# EAGLE design RasPi-BplusHAT_CamSlot (EAGLE 7.2.0)
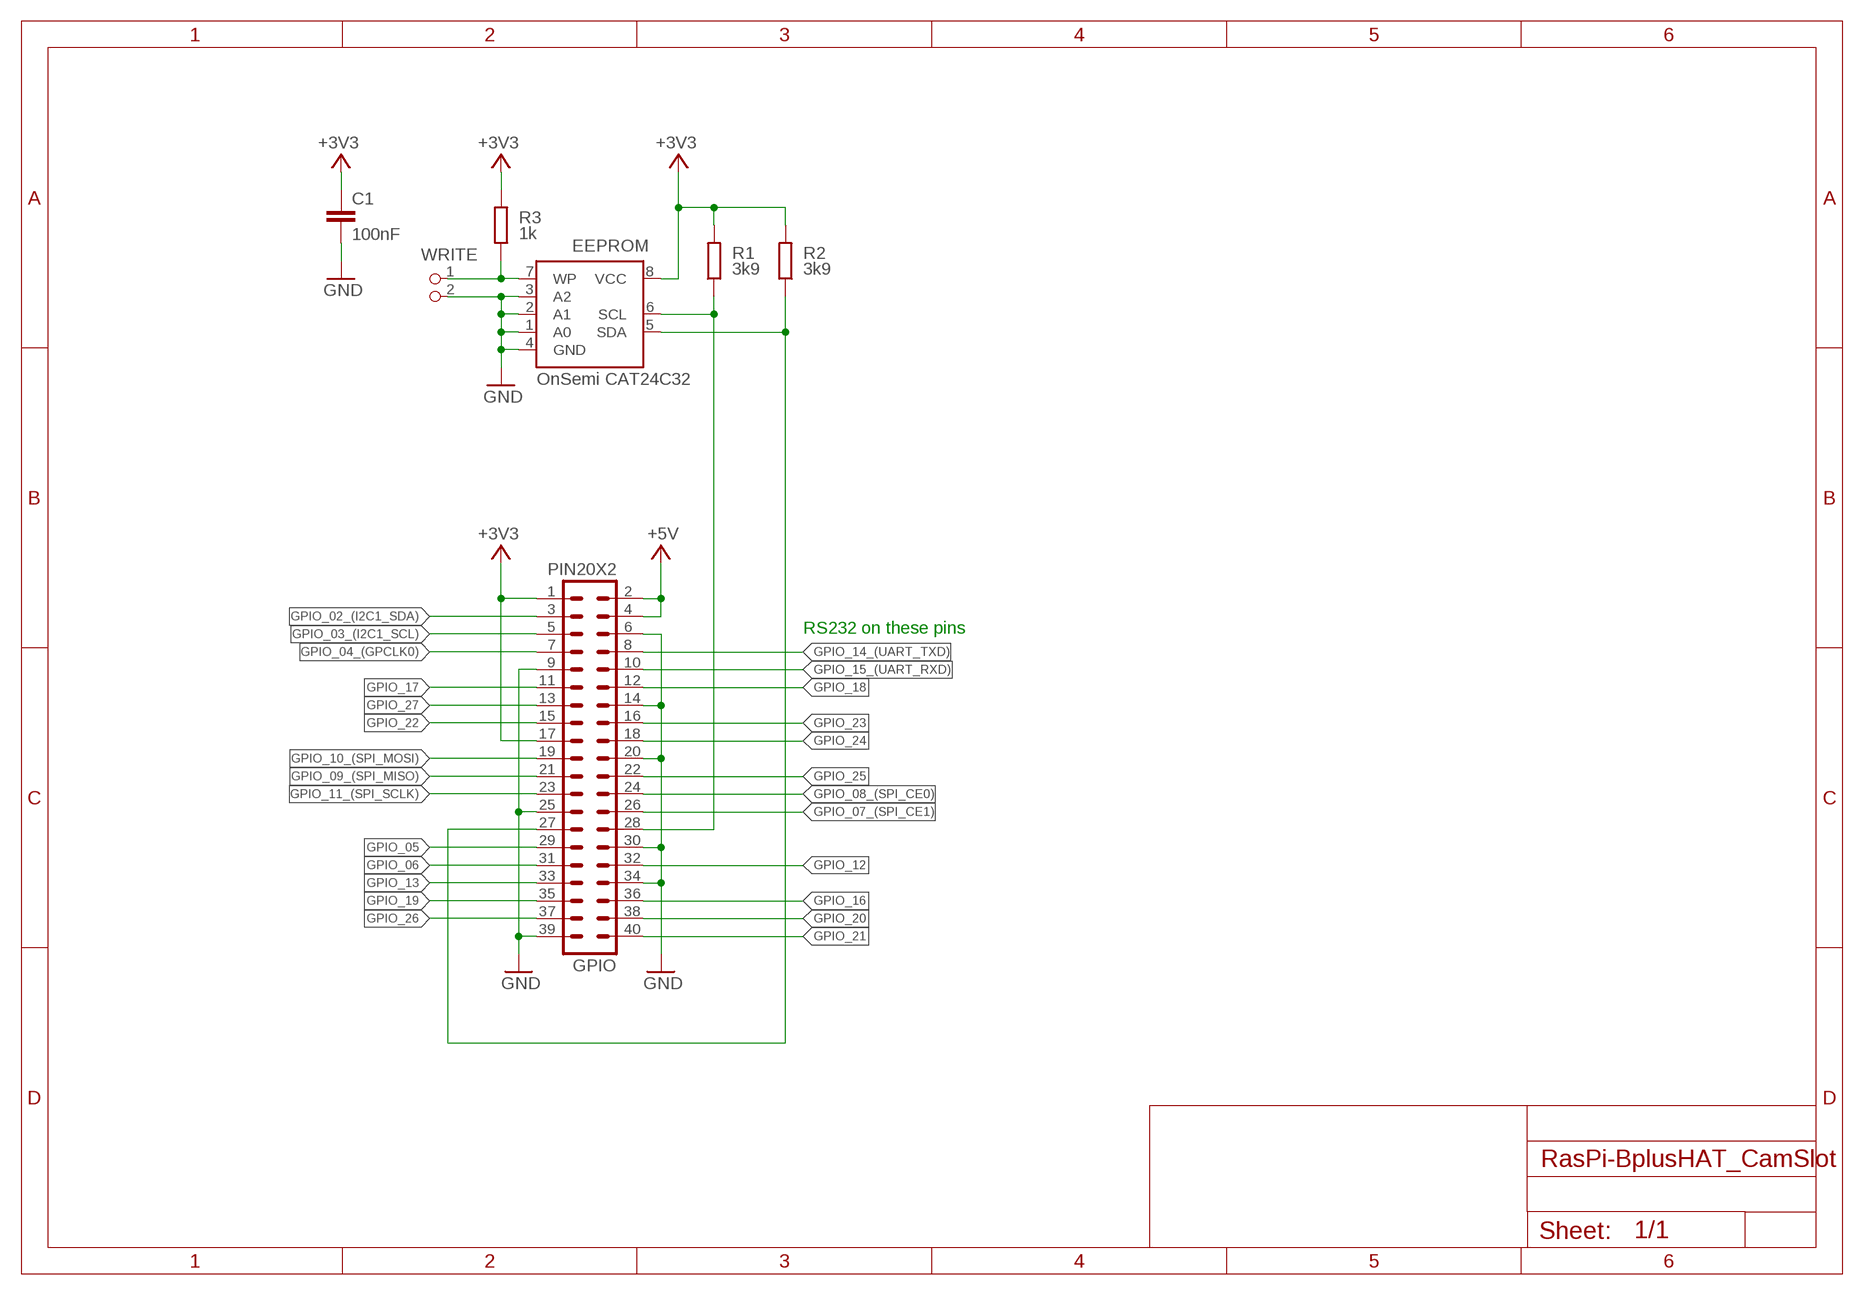
[diagram p0: schematic, sheet 1]

## Parts
C1  100nF  C-EUC0805K  [C0805K]
EEPROM  OnSemi CAT24C32  EEPROM24  [SOIC8]
GPIO  PIN20X2  [PIN_20X2]
R1  3k9  R-EU_M0805  [M0805]
R2  3k9  R-EU_M0805  [M0805]
R3  1k  R-EU_M0805  [M0805]
WRITE  PIN2_100  [PIN_W_2]

## Nets
+3V3: C1.1 EEPROM.8(VCC) GPIO.1 GPIO.17 R1.2 R2.2 R3.2
+5V: GPIO.2 GPIO.4
GND: C1.2 EEPROM.1(A0) EEPROM.2(A1) EEPROM.3(A2) EEPROM.4(GND) GPIO.6 GPIO.9 GPIO.14 GPIO.20 GPIO.25 GPIO.30 GPIO.34 GPIO.39 WRITE.2
GPIO_02_(I2C1_SDA): GPIO.3
GPIO_03_(I2C1_SCL): GPIO.5
GPIO_04_(GPCLK0): GPIO.7
GPIO_05: GPIO.29
GPIO_06: GPIO.31
GPIO_07_(SPI_CE1): GPIO.26
GPIO_08_(SPI_CE0): GPIO.24
GPIO_09_(SPI_MISO): GPIO.21
GPIO_10_(SPI_MOSI): GPIO.19
GPIO_11_(SPI_SCLK): GPIO.23
GPIO_12: GPIO.32
GPIO_13: GPIO.33
GPIO_14_(UART_TXD): GPIO.8
GPIO_15_(UART_RXD): GPIO.10
GPIO_16: GPIO.36
GPIO_17: GPIO.11
GPIO_18: GPIO.12
GPIO_19: GPIO.35
GPIO_20: GPIO.38
GPIO_21: GPIO.40
GPIO_22: GPIO.15
GPIO_23: GPIO.16
GPIO_24: GPIO.18
GPIO_25: GPIO.22
GPIO_26: GPIO.37
GPIO_27: GPIO.13
ID_SC: EEPROM.6(SCL) GPIO.28 R1.1
ID_SD: EEPROM.5(SDA) GPIO.27 R2.1
WWPROM_WP: EEPROM.7(WP) R3.1 WRITE.1

## Notes on the sheet
- RS232 on these pins

## Library data of the parts
C1 = resistor:C-EU: CAPACITOR, European symbol; DIELECTRIC: X7R
EEPROM = FLYFISH:EEPROM24
GPIO = FLYFISH:PIN20X2
R1-R3 = resistor:R-EU_: RESISTOR, European symbol; TOLERANCE: 5%
WRITE = FLYFISH:PIN2

## Board
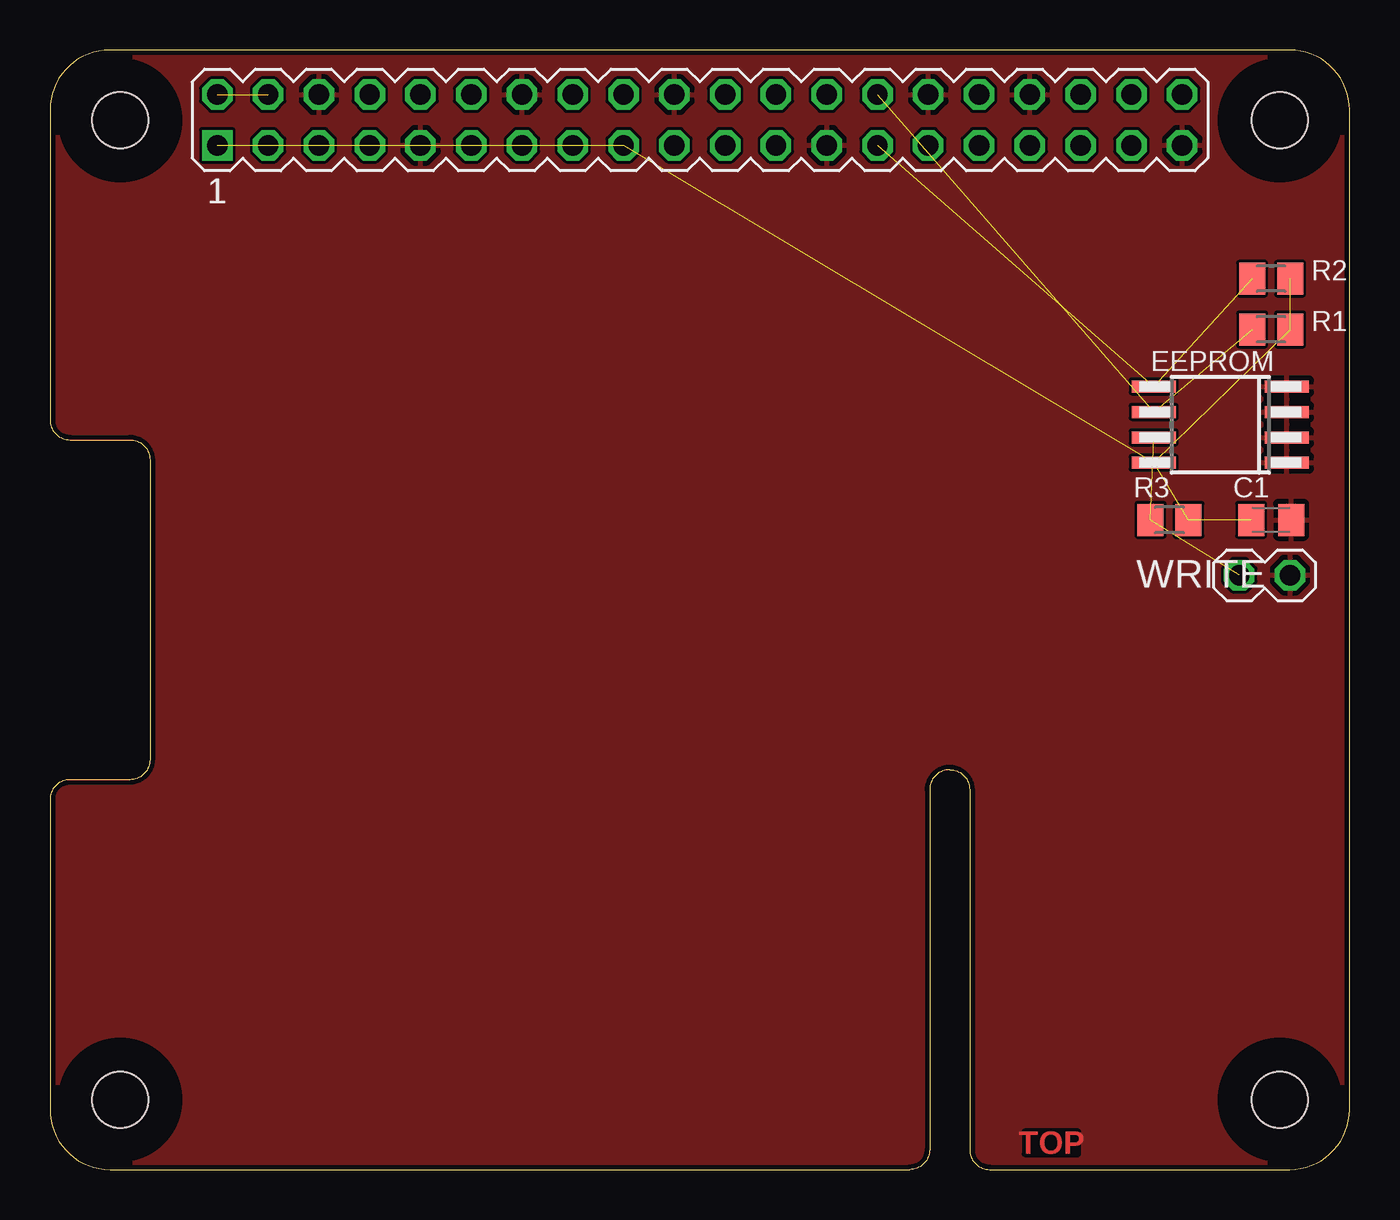
[diagram p1: board, top side]
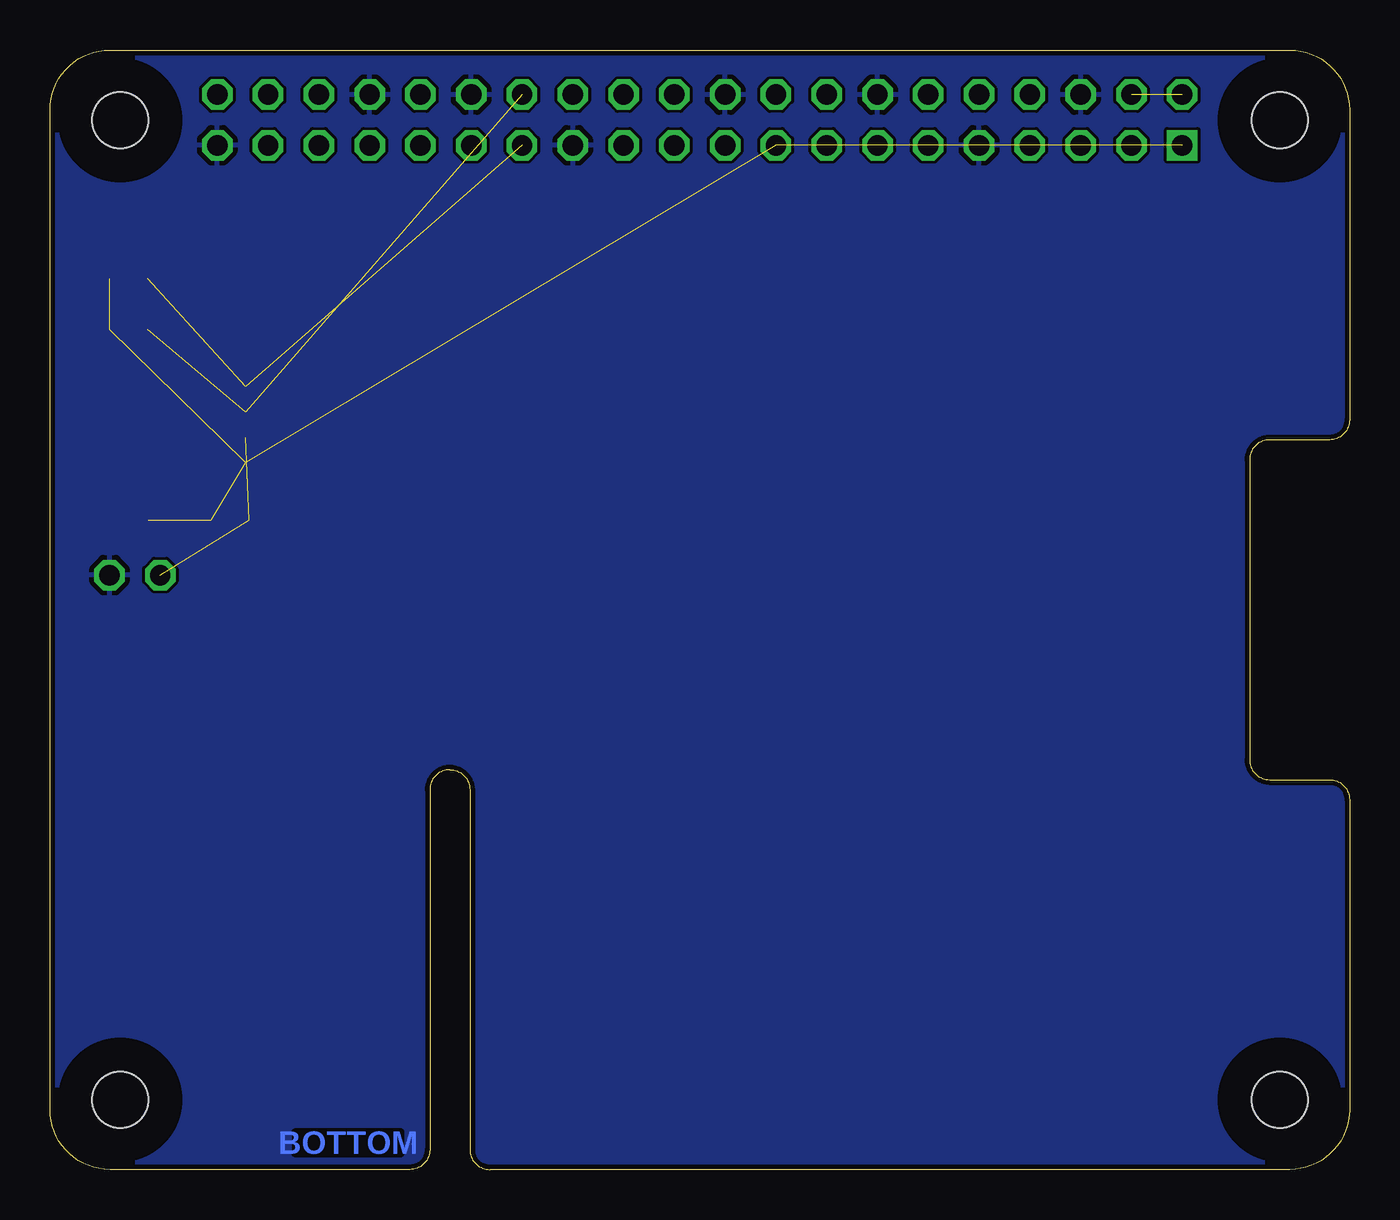
[diagram p2: board, bottom side, seen from below]

Size 65 x 56 mm. Coordinates in mm from the lower left corner, seen from the top.
Outline: 0,3 arc90 3,0 43,0 arc90 44,1 44,19 arc-90 45,20 arc-90 46,19 46,1 arc90 47,0 62,0 arc90 65,3 65,53 arc90 62,56 3,56 arc90 0,53 0,37.5 arc90 1,36.5 4,36.5 arc-90 5,35.5 5,20.5 arc-90 4,19.5 1,19.5 arc90 0,18.5 0,3
Copper layers (1*16): Top 0.035mm / dielectric 1.5mm / Bottom 0.035mm
Design rules "ITEADstudio_DRC": minimum track width 6mil, minimum drill 12mil, track to track 6mil, track to pad 6mil, pad to pad 6mil, via to via 6mil, smd to smd 0mil, copper to edge 10mil, drill to drill 10mil, minimum pad ring 10mil, minimum via ring 6mil, stop-mask expansion 2mil, vias tented up to drill 100mil, thermal gap 10mil
Holes 2.8 mm at 3.5,3.5 3.5,52.5 61.5,52.5 61.5,3.5
tRestrict: area 1.9,51 to 5,54; area 60,51 to 63,54; area 60,1.9 to 63,5; area 1.9,1.9 to 5,5
bRestrict: area 1.9,1.9 to 5,5; area 1.9,51 to 5,54; area 60,1.9 to 63,5; area 60,51 to 63,54

### Footprints (pad centres in the part's own frame; a part is rotated, then mirrored left to right if it is on the bottom)
C0805K = smd 1.3 x 1.6: 1 -1,0; 2 1,0
SOIC8 = smd 0.6 x 2.2: 1 -1.905,-3.33; 2 -0.635,-3.33; 3 0.635,-3.33; 4 1.905,-3.33; 5 1.905,3.33; 6 0.635,3.33; 7 -0.635,3.33; 8 -1.905,3.33
PIN_20X2 = drill 1.016 square: 1 -24.13,-1.27 | drill 1.016 octagon: 2 -24.13,1.27; 3 -21.59,-1.27; 4 -21.59,1.27; 5 -19.05,-1.27; 6 -19.05,1.27; 7 -16.51,-1.27; 8 -16.51,1.27; 9 -13.97,-1.27; 10 -13.97,1.27; 11 -11.43,-1.27; 12 -11.43,1.27; 13 -8.89,-1.27; 14 -8.89,1.27; 15 -6.35,-1.27; 16 -6.35,1.27; 17 -3.81,-1.27; 18 -3.81,1.27; 19 -1.27,-1.27; 20 -1.27,1.27; 21 1.27,-1.27; 22 1.27,1.27; 23 3.81,-1.27; 24 3.81,1.27; 25 6.35,-1.27; 26 6.35,1.27; 27 8.89,-1.27; 28 8.89,1.27; 29 11.43,-1.27; 30 11.43,1.27; 31 13.97,-1.27; 32 13.97,1.27; 33 16.51,-1.27; 34 16.51,1.27; 35 19.05,-1.27; 36 19.05,1.27; 37 21.59,-1.27; 38 21.59,1.27; 39 24.13,-1.27; 40 24.13,1.27
M0805 = smd 1.3 x 1.6: 1 -0.95,0; 2 0.95,0
PIN_W_2 = drill 1.016 octagon: 1 0,0; 2 0,-2.54

### Placement (x,y rotation side)
C1  61.08,32.5 0 top
EEPROM  58.53,37.26 90 top
GPIO  32.5,52.5 0 top
R1  61.08,42.02 0 top
R2  61.08,44.56 0 top
R3  55.99,32.5 0 top
WRITE  59.48,29.73 90 top

### Tracks (layer width: path | path; a pad name or v marks a point on that pad's centre or on a via)
+3V3  (6 unrouted)
+5V  (1 unrouted)
GND
  pour Bottom: 0,3 arc90 3,0 43,0 arc90 44,1 44,19 arc-90 45,20 arc-90 46,19 46,1 arc90 47,0 62,0 arc90 65,3 65,53 arc90 62,56 3,56 arc90 0,53 0,37.5 arc90 1,36.5 4,36.5 arc-90 5,35.5 5,20.5 arc-90 4,19.5 1,19.5 arc90 0,18.5
  pour Top: 0,3 arc90 3,0 43,0 arc90 44,1 44,19 arc-90 45,20 arc-90 46,19 46,1 arc90 47,0 62,0 arc90 65,3 65,53 arc90 62,56 3,56 arc90 0,53 0,37.5 arc90 1,36.5 4,36.5 arc-90 5,35.5 5,20.5 arc-90 4,19.5 1,19.5 arc90 0,18.5
ID_SC  (2 unrouted)
ID_SD  (2 unrouted)
WWPROM_WP  (2 unrouted)

### Text on the board
Top: TOP
Bottom: BOTTOM